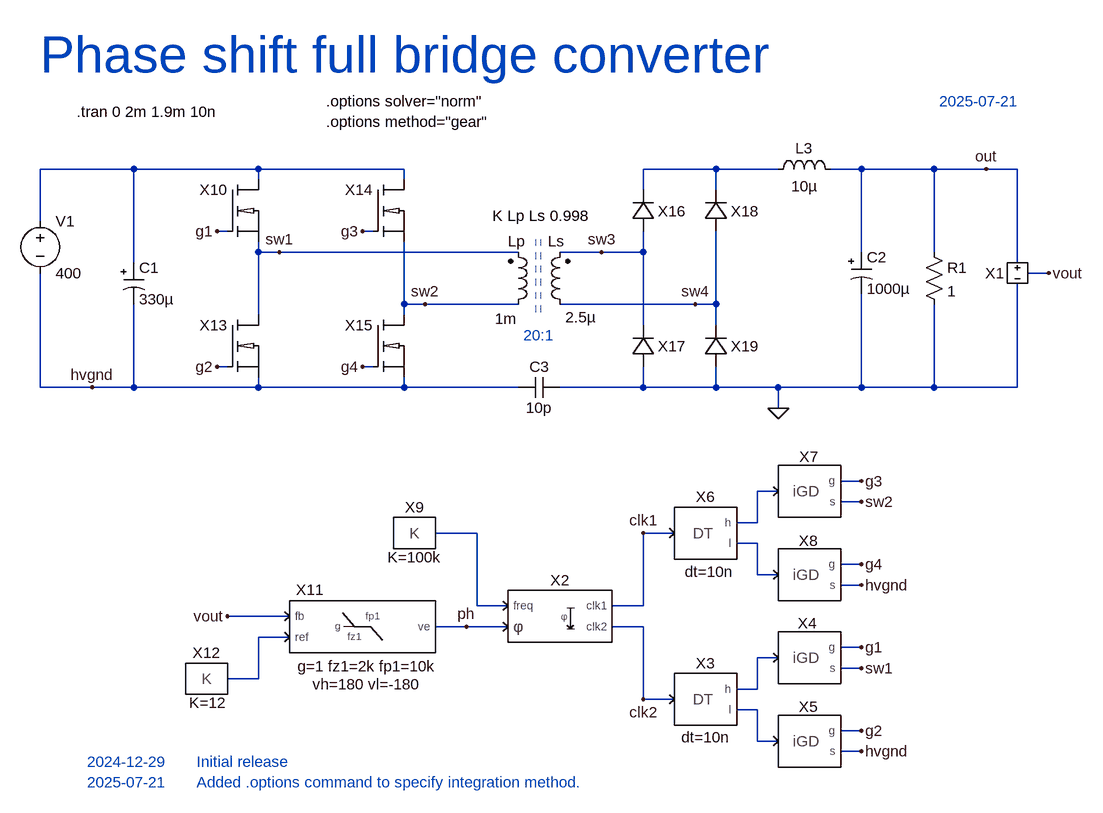
[diagram p0: schematic PSFB2.asc]
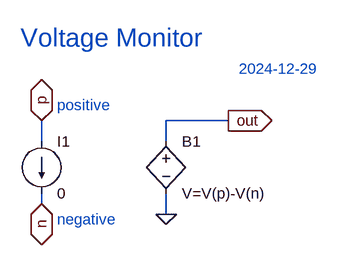
[diagram p1: sub-circuit vmon.asc]
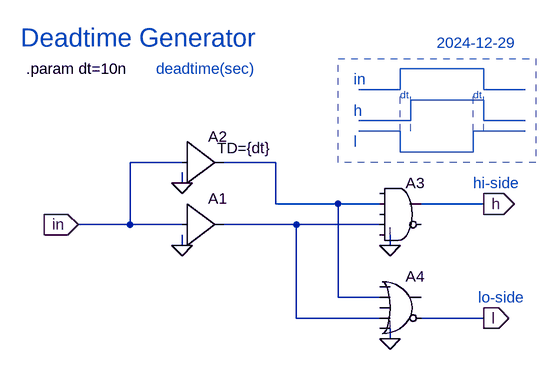
[diagram p2: sub-circuit deadtime.asc]
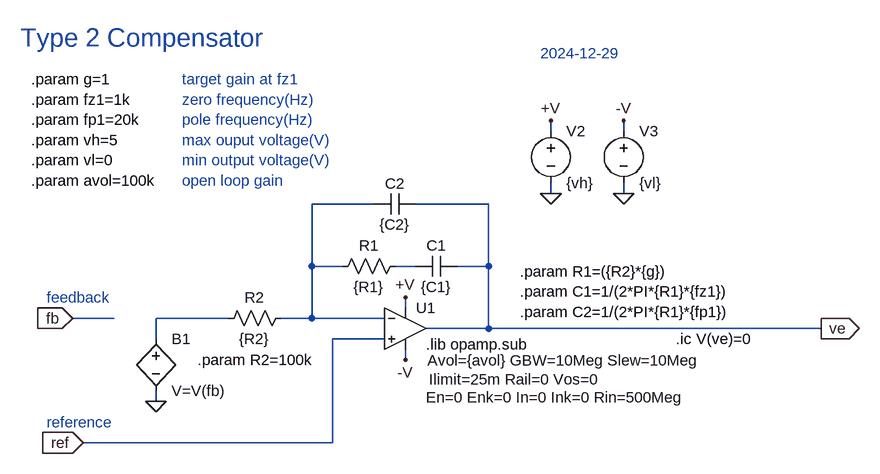
[diagram p3: sub-circuit type2.asc]
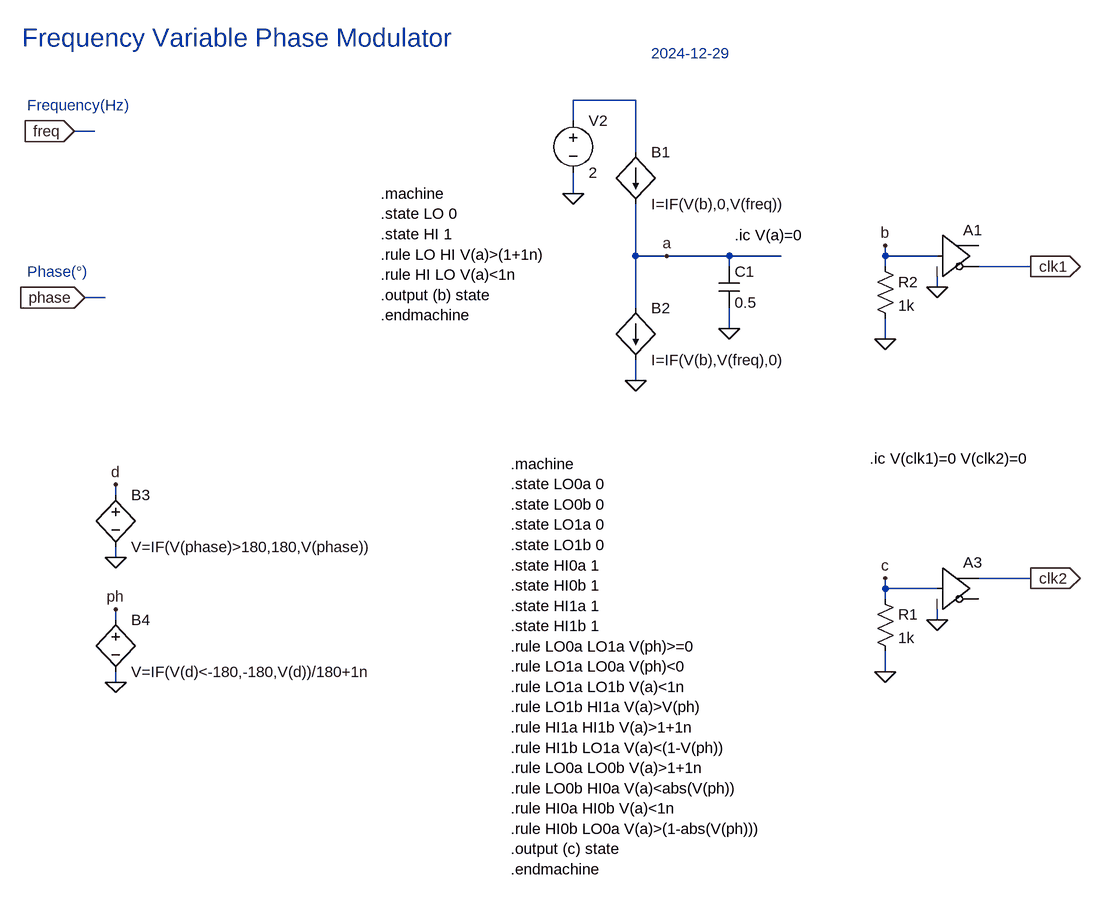
[diagram p4: sub-circuit phaseshift2.asc]
PSFB2.asc, the LTspice schematic file:
Version 4.1
SHEET 1 1968 1000
WIRE 128 -16 -16 -16
WIRE 320 -16 128 -16
WIRE 544 -16 320 -16
WIRE 1024 -16 912 -16
WIRE 1120 -16 1024 -16
WIRE 1248 -16 1200 -16
WIRE 1360 -16 1248 -16
WIRE 1440 -16 1360 -16
WIRE 1488 -16 1440 -16
WIRE 320 0 320 -16
WIRE 544 0 544 -16
WIRE 912 16 912 -16
WIRE 1024 16 1024 -16
WIRE -16 64 -16 -16
WIRE 272 80 256 80
WIRE 496 80 480 80
WIRE 320 112 320 96
WIRE 352 112 320 112
WIRE 720 112 352 112
WIRE 848 112 784 112
WIRE 912 112 912 80
WIRE 912 112 848 112
WIRE 1248 112 1248 -16
WIRE 1360 112 1360 -16
WIRE 128 128 128 -16
WIRE 1488 128 1488 -16
WIRE 1536 144 1504 144
WIRE 544 192 544 96
WIRE 576 192 544 192
WIRE 720 192 576 192
WIRE 992 192 784 192
WIRE 1024 192 1024 80
WIRE 1024 192 992 192
WIRE 320 208 320 112
WIRE 544 208 544 192
WIRE 912 224 912 112
WIRE 1024 224 1024 192
WIRE 272 288 256 288
WIRE 496 288 480 288
WIRE -16 320 -16 144
WIRE 64 320 -16 320
WIRE 128 320 128 192
WIRE 128 320 64 320
WIRE 320 320 320 304
WIRE 320 320 128 320
WIRE 544 320 544 304
WIRE 544 320 320 320
WIRE 720 320 544 320
WIRE 912 320 912 288
WIRE 912 320 784 320
WIRE 1024 320 1024 288
WIRE 1024 320 912 320
WIRE 1120 320 1024 320
WIRE 1248 320 1248 176
WIRE 1248 320 1120 320
WIRE 1360 320 1360 192
WIRE 1360 320 1248 320
WIRE 1488 320 1488 160
WIRE 1488 320 1360 320
WIRE 1120 352 1120 320
WIRE 1248 464 1216 464
WIRE 1120 480 1088 480
WIRE 1248 496 1216 496
WIRE 1088 528 1088 480
WIRE 1088 528 1056 528
WIRE 656 544 592 544
WIRE 960 544 912 544
WIRE 1088 560 1056 560
WIRE 1248 592 1216 592
WIRE 1088 608 1088 560
WIRE 1120 608 1088 608
WIRE 1248 624 1216 624
WIRE 656 656 656 544
WIRE 704 656 656 656
WIRE 912 656 912 544
WIRE 912 656 864 656
WIRE 368 672 272 672
WIRE 640 688 592 688
WIRE 704 688 640 688
WIRE 912 688 864 688
WIRE 368 704 320 704
WIRE 1248 720 1216 720
WIRE 1120 736 1088 736
WIRE 1248 752 1216 752
WIRE 320 768 320 704
WIRE 320 768 272 768
WIRE 1088 784 1088 736
WIRE 1088 784 1056 784
WIRE 912 800 912 688
WIRE 960 800 912 800
WIRE 1088 816 1056 816
WIRE 1248 848 1216 848
WIRE 1088 864 1088 816
WIRE 1120 864 1088 864
WIRE 1248 880 1216 880
FLAG 256 80 g1
FLAG 256 288 g2
FLAG 352 112 sw1
FLAG 480 80 g3
FLAG 480 288 g4
FLAG 576 192 sw2
FLAG 1440 -16 out
FLAG 1536 144 vout
FLAG 1248 720 g1
FLAG 1248 752 sw1
FLAG 1248 848 g2
FLAG 1248 464 g3
FLAG 1248 496 sw2
FLAG 1248 592 g4
FLAG 272 672 vout
FLAG 640 688 ph
FLAG 912 544 clk1
FLAG 912 800 clk2
FLAG 64 320 hvgnd
FLAG 1248 624 hvgnd
FLAG 1248 880 hvgnd
FLAG 848 112 sw3
FLAG 992 192 sw4
FLAG 1120 352 0
SYMBOL voltage -16 48 R0
WINDOW 123 0 0 Left 0
WINDOW 39 0 0 Left 0
SYMATTR InstName V1
SYMATTR Value 400
SYMBOL polcap 112 128 R0
WINDOW 3 24 56 Left 2
SYMATTR Value 330µ
SYMATTR InstName C1
SYMATTR Description Capacitor
SYMATTR Type cap
SYMATTR SpiceLine Irms=1.5 Rser=0.1
SYMBOL ind2 704 208 M180
WINDOW 0 0 113 Left 2
WINDOW 3 -20 -6 Left 2
SYMATTR InstName Lp
SYMATTR Value 1m
SYMATTR SpiceLine Rser=1m
SYMBOL ind2 800 208 R180
WINDOW 0 9 113 Left 2
WINDOW 3 -40 -4 Left 2
SYMATTR InstName Ls
SYMATTR Value 2.5µ
SYMATTR SpiceLine Rser=1m
SYMBOL ind 1104 0 R270
WINDOW 0 32 56 VTop 2
WINDOW 3 5 56 VBottom 2
SYMATTR InstName L3
SYMATTR Value 10µ
SYMATTR SpiceLine Rser=1m
SYMBOL polcap 1232 112 R0
WINDOW 3 24 56 Left 2
SYMATTR Value 1000µ
SYMATTR InstName C2
SYMATTR Description Capacitor
SYMATTR Type cap
SYMATTR SpiceLine Rser=0.1
SYMBOL VMON 1488 144 R0
SYMATTR InstName X1
SYMBOL DEADTIME 1008 800 R0
WINDOW 39 0 74 Bottom 2
SYMATTR InstName X3
SYMBOL iGD 1168 736 R0
WINDOW 0 -3 -69 Top 2
SYMATTR InstName X4
SYMBOL iGD 1168 864 R0
WINDOW 0 -2 -68 Top 2
SYMATTR InstName X5
SYMBOL DEADTIME 1008 544 R0
WINDOW 39 6 75 Bottom 2
SYMATTR InstName X6
SYMBOL iGD 1168 480 R0
WINDOW 0 -1 -69 Top 2
SYMATTR InstName X7
SYMBOL iGD 1168 608 R0
WINDOW 0 -2 -68 Top 2
SYMATTR InstName X8
SYMBOL res 1344 96 R0
SYMATTR InstName R1
SYMATTR Value 1
SYMBOL TYPE2 480 688 R0
WINDOW 0 -81 -57 Center 2
WINDOW 39 7 61 Center 2
WINDOW 40 7 89 Center 2
SYMATTR InstName X11
SYMATTR SpiceLine g=1 fz1=2k fp1=10k
SYMATTR SpiceLine2 vh=180 vl=-180
SYMBOL CONST 240 768 R0
WINDOW 39 2 53 Bottom 2
SYMATTR SpiceLine K=12
SYMATTR InstName X12
SYMBOL PHASESHIFT2 784 672 R0
WINDOW 0 0 -71 Top 2
SYMATTR InstName X2
SYMBOL CONST 560 544 R0
WINDOW 39 0 53 Bottom 2
SYMATTR SpiceLine K=100k
SYMATTR InstName X9
SYMBOL iD 912 48 R180
SYMATTR InstName X16
SYMBOL iD 912 256 R180
SYMATTR InstName X17
SYMBOL iD 1024 48 R180
SYMATTR InstName X18
SYMBOL iD 1024 256 R180
SYMATTR InstName X19
SYMBOL iNMOS 320 48 R0
SYMATTR InstName X10
SYMBOL iNMOS 320 256 R0
SYMATTR InstName X13
SYMBOL iNMOS 544 48 R0
SYMATTR InstName X14
SYMBOL iNMOS 544 256 R0
SYMATTR InstName X15
SYMBOL cap 784 304 R90
WINDOW 0 0 32 VBottom 2
WINDOW 3 32 32 VTop 2
SYMATTR InstName C3
SYMATTR Value 10p
TEXT 680 56 Left 2 !K Lp Ls 0.998
TEXT 728 240 Left 2 ;20:1
TEXT 40 -104 Left 2 !.tran 0 2m 1.9m 10n
TEXT -16 -192 Left 6 ;Phase shift full bridge converter
TEXT 1368 -120 Left 2 ;2025-07-21
TEXT 424 -120 Left 2 !.options solver="norm"\n.options method="gear"
TEXT 56 896 Left 2 ;2024-12-29       Initial release\n2025-07-21       Added .options command to specify integration method.
LINE Normal 747 204 747 92 1
LINE Normal 755 204 755 92 1

vmon.asc, the sub-circuit schematic file:
Version 4
SHEET 1 880 680
WIRE 176 -32 80 -32
WIRE -112 0 -112 -32
WIRE 80 0 80 -32
WIRE -112 96 -112 80
WIRE 80 112 80 80
FLAG -112 -32 p
IOPIN -112 -32 BiDir
FLAG -112 96 n
IOPIN -112 96 BiDir
FLAG 176 -32 out
IOPIN 176 -32 Out
FLAG 80 112 0
SYMBOL bv 80 -16 R0
SYMATTR InstName B1
SYMATTR Value V=V(p)-V(n)
SYMBOL current -112 0 R0
WINDOW 123 0 0 Left 0
WINDOW 39 0 0 Left 0
SYMATTR InstName I1
SYMATTR Value 0
TEXT -144 -160 Left 4 ;Voltage Monitor
TEXT -88 -56 Left 2 ;positive
TEXT -88 120 Left 2 ;negative
TEXT 192 -112 Left 2 ;2024-12-29

deadtime.asc, the sub-circuit schematic file:
Version 4
SHEET 1 1412 1312
WIRE 64 288 -16 288
WIRE 208 288 128 288
WIRE 64 320 64 304
WIRE 208 352 208 288
WIRE 304 352 208 352
WIRE 368 352 304 352
WIRE 528 352 432 352
WIRE -16 384 -16 288
WIRE -16 384 -96 384
WIRE 64 384 -16 384
WIRE 240 384 128 384
WIRE 368 384 240 384
WIRE 64 416 64 400
WIRE 384 416 384 400
WIRE 304 496 304 352
WIRE 368 496 304 496
WIRE 240 528 240 384
WIRE 368 528 240 528
WIRE 528 528 432 528
WIRE 384 560 384 544
FLAG -96 384 in
IOPIN -96 384 In
FLAG 64 416 0
FLAG 64 320 0
FLAG 384 416 0
FLAG 384 560 0
FLAG 528 352 h
IOPIN 528 352 Out
FLAG 528 528 l
IOPIN 528 528 Out
SYMBOL Digital\\buf1 64 320 R0
SYMATTR InstName A1
SYMBOL Digital\\buf1 64 224 R0
WINDOW 3 54 42 Left 2
SYMATTR Value TD={dt}
SYMATTR InstName A2
SYMBOL Digital\\and 400 304 R0
SYMATTR InstName A3
SYMBOL Digital\\or 400 448 R0
SYMATTR InstName A4
TEXT -176 144 Left 2 !.param dt=10n
TEXT -184 96 Left 4 ;Deadtime Generator
TEXT 24 144 Left 2 ;deadtime(sec)
TEXT 512 320 Left 2 ;hi-side
TEXT 520 496 Left 2 ;lo-side
TEXT 328 160 Left 2 ;in
TEXT 328 208 Left 2 ;h
TEXT 328 256 Left 2 ;l
TEXT 400 184 Left 1 ;dt
TEXT 512 184 Left 1 ;dt
TEXT 456 104 Left 2 ;2024-12-29
LINE Normal 400 176 336 176
LINE Normal 400 176 400 144
LINE Normal 528 144 400 144
LINE Normal 528 176 528 144
LINE Normal 592 176 528 176
LINE Normal 416 224 336 224
LINE Normal 416 224 416 192
LINE Normal 528 192 416 192
LINE Normal 528 224 528 192
LINE Normal 592 224 528 224
LINE Normal 400 240 336 240
LINE Normal 400 272 400 240
LINE Normal 512 272 400 272
LINE Normal 512 272 512 240
LINE Normal 592 240 512 240
LINE Normal 400 240 400 176 2
LINE Normal 512 240 512 176 2
LINE Normal 416 240 416 176 2
LINE Normal 528 240 528 176 2
RECTANGLE Normal 608 288 304 128 2

type2.asc, the sub-circuit schematic file:
Version 4
SHEET 1 1008 680
WIRE 464 -144 464 -160
WIRE 576 -144 576 -160
WIRE 464 -48 464 -64
WIRE 576 -48 576 -64
WIRE 192 -32 96 -32
WIRE 368 -32 256 -32
WIRE 96 64 96 -32
WIRE 144 64 96 64
WIRE 256 64 224 64
WIRE 368 64 368 -32
WIRE 368 64 320 64
WIRE 240 128 240 112
WIRE -208 144 -272 144
WIRE -32 144 -144 144
WIRE 96 144 96 64
WIRE 96 144 48 144
WIRE 208 144 96 144
WIRE 368 160 368 64
WIRE 368 160 272 160
WIRE 880 160 368 160
WIRE -144 176 -144 144
WIRE 208 176 128 176
WIRE 240 208 240 192
WIRE -144 272 -144 256
WIRE 128 336 128 176
WIRE 128 336 -256 336
FLAG -272 144 fb
IOPIN -272 144 In
FLAG -256 336 ref
IOPIN -256 336 In
FLAG -144 272 0
FLAG 880 160 ve
IOPIN 880 160 Out
FLAG 576 -48 0
FLAG 464 -48 0
FLAG 464 -160 +V
FLAG 576 -160 -V
FLAG 240 112 +V
FLAG 240 208 -V
SYMBOL res 240 48 R90
WINDOW 0 0 56 VBottom 2
WINDOW 3 32 56 VTop 2
SYMATTR InstName R1
SYMATTR Value {R1}
SYMBOL cap 320 48 R90
WINDOW 0 0 32 VBottom 2
WINDOW 3 32 32 VTop 2
SYMATTR InstName C1
SYMATTR Value {C1}
SYMBOL cap 256 -48 R90
WINDOW 0 0 32 VBottom 2
WINDOW 3 32 32 VTop 2
SYMATTR InstName C2
SYMATTR Value {C2}
SYMBOL bv -144 160 R0
SYMATTR InstName B1
SYMATTR Value V=V(fb)
SYMBOL res 64 128 R90
WINDOW 0 0 56 VBottom 2
WINDOW 3 32 56 VTop 2
SYMATTR InstName R2
SYMATTR Value {R2}
SYMBOL UniversalOpAmp2 240 160 R0
WINDOW 123 34 49 Left 2
WINDOW 39 36 78 Left 2
WINDOW 40 32 106 Left 2
SYMATTR Value2 Avol={avol} GBW=10Meg Slew=10Meg
SYMATTR InstName U1
SYMBOL voltage 464 -160 R0
SYMATTR InstName V2
SYMATTR Value {vh}
SYMBOL voltage 576 -160 R0
SYMATTR InstName V3
SYMATTR Value {vl}
TEXT 272 184 Left 2 !.lib opamp.sub
TEXT -336 -224 Left 2 !.param g=1\n.param fz1=1k\n.param fp1=20k\n.param vh=5\n.param vl=0\n.param avol=100k
TEXT 416 72 Left 2 !.param R1=({R2}*{g})\n.param C1=1/(2*PI*{R1}*{fz1})\n.param C2=1/(2*PI*{R1}*{fp1})
TEXT -352 -288 Left 4 ;Type 2 Compensator
TEXT -80 208 Left 2 !.param R2=100k
TEXT -104 -224 Left 2 ;target gain at fz1\nzero frequency(Hz)\npole frequency(Hz)\nmax ouput voltage(V)\nmin output voltage(V)\nopen loop gain
TEXT -312 112 Left 2 ;feedback
TEXT -312 304 Left 2 ;reference
TEXT 656 176 Left 2 !.ic V(ve)=0
TEXT 448 -264 Left 2 ;2024-12-29

phaseshift2.asc, the sub-circuit schematic file:
Version 4
SHEET 1 1572 1312
WIRE -128 -112 -224 -112
WIRE -224 -80 -224 -112
WIRE -960 -64 -992 -64
WIRE -128 -32 -128 -112
WIRE -224 32 -224 0
WIRE -128 128 -128 48
WIRE -80 128 -128 128
WIRE 16 128 -80 128
WIRE 96 128 16 128
WIRE 256 128 256 112
WIRE 336 128 256 128
WIRE 16 144 16 128
WIRE 256 144 256 128
WIRE 480 144 400 144
WIRE 336 176 336 160
WIRE -944 192 -976 192
WIRE -128 208 -128 128
WIRE 16 240 16 208
WIRE 256 256 256 224
WIRE -128 320 -128 288
WIRE -928 496 -928 480
WIRE -928 592 -928 576
WIRE 480 624 400 624
WIRE 256 640 256 624
WIRE 336 640 256 640
WIRE 256 656 256 640
WIRE -928 688 -928 672
WIRE 336 688 336 672
WIRE 256 768 256 736
WIRE -928 784 -928 768
FLAG -992 -64 freq
IOPIN -992 -64 In
FLAG 16 240 0
FLAG -224 32 0
FLAG -976 192 phase
IOPIN -976 192 In
FLAG -128 320 0
FLAG 256 256 0
FLAG -80 128 a
FLAG -928 592 0
FLAG -928 480 d
FLAG 480 144 clk1
IOPIN 480 144 Out
FLAG 336 176 0
FLAG 256 112 b
FLAG 256 768 0
FLAG 480 624 clk2
IOPIN 480 624 Out
FLAG 336 688 0
FLAG 256 624 c
FLAG -928 784 0
FLAG -928 672 ph
SYMBOL cap 0 144 R0
SYMATTR InstName C1
SYMATTR Value 0.5
SYMBOL voltage -224 -96 R0
WINDOW 123 0 0 Left 0
WINDOW 39 0 0 Left 0
SYMATTR InstName V2
SYMATTR Value 2
SYMBOL bi -128 -32 R0
SYMATTR InstName B1
SYMATTR Value I=IF(V(b),0,V(freq))
SYMBOL bi -128 208 R0
SYMATTR InstName B2
SYMATTR Value I=IF(V(b),V(freq),0)
SYMBOL res 240 128 R0
SYMATTR InstName R2
SYMATTR Value 1k
SYMBOL bv -928 480 R0
SYMATTR InstName B3
SYMATTR Value V=IF(V(phase)>180,180,V(phase))
SYMBOL Digital\\buf 336 64 R0
SYMATTR InstName A1
SYMBOL res 240 640 R0
SYMATTR InstName R1
SYMATTR Value 1k
SYMBOL Digital\\buf 336 576 R0
SYMATTR InstName A3
SYMBOL bv -928 672 R0
SYMATTR InstName B4
SYMATTR Value V=IF(V(d)<-180,-180,V(d))/180+1n
TEXT -520 32 Left 2 !.machine\n.state LO 0\n.state HI 1\n.rule LO HI V(a)>(1+1n)\n.rule HI LO V(a)<1n\n.output (b) state\n.endmachine
TEXT 24 96 Left 2 !.ic V(a)=0
TEXT -320 448 Left 2 !.machine\n.state LO0a 0\n.state LO0b 0\n.state LO1a 0\n.state LO1b 0\n.state HI0a 1\n.state HI0b 1\n.state HI1a 1\n.state HI1b 1\n.rule LO0a LO1a V(ph)>=0\n.rule LO1a LO0a V(ph)<0\n.rule LO1a LO1b V(a)<1n\n.rule LO1b HI1a V(a)>V(ph)\n.rule HI1a HI1b V(a)>1+1n\n.rule HI1b LO1a V(a)<(1-V(ph))\n.rule LO0a LO0b V(a)>1+1n\n.rule LO0b HI0a V(a)<abs(V(ph))\n.rule HI0a HI0b V(a)<1n\n.rule HI0b LO0a V(a)>(1-abs(V(ph)))\n.output (c) state\n.endmachine
TEXT 232 440 Left 2 !.ic V(clk1)=0 V(clk2)=0
TEXT -1072 -208 Left 4 ;Frequency Variable Phase Modulator
TEXT -1064 -104 Left 2 ;Frequency(Hz)
TEXT -1064 152 Left 2 ;Phase(°)
TEXT -104 -184 Left 2 ;2024-12-29

The netlist it stands for:
* PSFB2.asc
V1 N001 hvgnd 400
C1 N001 hvgnd 330µ Irms=1.5 Rser=0.1
Lp sw2 sw1 1m Rser=1m
Ls sw4 sw3 2.5µ Rser=1m
L3 N002 out 10µ Rser=1m
C2 out 0 1000µ Rser=0.1
X§X1 0 vout out vmon
X§X3 clk2 N008 N007 deadtime params: dt=10n
X§X4 N007 g1 sw1 iGD  ; pins in g s
X§X5 N008 g2 hvgnd iGD  ; pins in g s
X§X6 clk1 N005 N003 deadtime params: dt=10n
X§X7 N003 g3 sw2 iGD  ; pins in g s
X§X8 N005 g4 hvgnd iGD  ; pins in g s
R1 out 0 1
X§X11 vout N006 ph type2 params: avol=100k g=1 fz1=2k fp1=10k vh=180 vl=-180
X§X12 N006 CONST K=12  ; pins K
X§X2 N004 ph clk1 clk2 phaseshift2
X§X9 N004 CONST K=100k  ; pins K
X§X16 sw3 N002 iD params: von=1n ron=10m esl=1f rsnb=1k csnb=10p  ; pins AN CA
X§X17 0 sw3 iD params: von=1n ron=10m esl=1f rsnb=1k csnb=10p  ; pins AN CA
X§X18 sw4 N002 iD params: von=1n ron=10m esl=1f rsnb=1k csnb=10p  ; pins AN CA
X§X19 0 sw4 iD params: von=1n ron=10m esl=1f rsnb=1k csnb=10p  ; pins AN CA
X§X10 N001 g1 sw1 iNMOS params: esl=1f rsnb=1k csnb=10p ron=10m  ; pins D G S
X§X13 sw1 g2 hvgnd iNMOS params: esl=1f rsnb=1k csnb=10p ron=10m  ; pins D G S
X§X14 N001 g3 sw2 iNMOS params: esl=1f rsnb=1k csnb=10p ron=10m  ; pins D G S
X§X15 sw2 g4 hvgnd iNMOS params: esl=1f rsnb=1k csnb=10p ron=10m  ; pins D G S
C3 0 hvgnd 10p

* block symbol definitions
.subckt vmon n out p
B1 out 0 V=V(p)-V(n)
I1 p n 0
* Voltage Monitor
* positive
* negative
* 2024-12-29
.ends vmon

.subckt deadtime in l h
A1 in 0 0 0 0 0 N002 0 BUF
A2 in 0 0 0 0 0 N001 0 BUF TD={dt}
A3 0 N001 0 N002 0 0 h 0 AND
A4 0 N001 0 N002 0 l 0 0 OR
.param dt=10n
* Deadtime Generator
* deadtime(sec)
* hi-side
* lo-side
* in
* h
* l
* dt
* dt
* 2024-12-29
.ends deadtime

.subckt type2 fb ref ve
R1 N002 N001 {R1}
C1 ve N002 {C1}
C2 ve N001 {C2}
B1 N003 0 V=V(fb)
R2 N001 N003 {R2}
XU1 ref N001 +V -V ve level2 Avol={avol} GBW=10Meg Slew=10Meg Ilimit=25m Rail=0 Vos=0 En=0 Enk=0 In=0 Ink=0 Rin=500Meg  ; pins In+ In- V+ V- OUT
V2 +V 0 {vh}
V3 -V 0 {vl}
.lib opamp.sub
.param g=1
.param fz1=1k
.param fp1=20k
.param vh=5
.param vl=0
.param avol=100k
.param R1=({R2}*{g})
.param C1=1/(2*PI*{R1}*{fz1})
.param C2=1/(2*PI*{R1}*{fp1})
* Type 2 Compensator
.param R2=100k
* target gain at fz1
* zero frequency(Hz)
* pole frequency(Hz)
* max ouput voltage(V)
* min output voltage(V)
* open loop gain
* feedback
* reference
.ic V(ve)=0
* 2024-12-29
.ends type2

.subckt phaseshift2 freq phase clk1 clk2
C1 a 0 0.5
V2 N001 0 2
B1 N001 a I=IF(V(b),0,V(freq))
B2 a 0 I=IF(V(b),V(freq),0)
R2 b 0 1k
B3 d 0 V=IF(V(phase)>180,180,V(phase))
A1 b 0 0 0 0 clk1 0 0 BUF
R1 c 0 1k
A3 c 0 0 0 0 0 clk2 0 BUF
B4 ph 0 V=IF(V(d)<-180,-180,V(d))/180+1n
.machine
.state LO 0
.state HI 1
.rule LO HI V(a)>(1+1n)
.rule HI LO V(a)<1n
.output (b) state
.endmachine
.ic V(a)=0
.machine
.state LO0a 0
.state LO0b 0
.state LO1a 0
.state LO1b 0
.state HI0a 1
.state HI0b 1
.state HI1a 1
.state HI1b 1
.rule LO0a LO1a V(ph)>=0
.rule LO1a LO0a V(ph)<0
.rule LO1a LO1b V(a)<1n
.rule LO1b HI1a V(a)>V(ph)
.rule HI1a HI1b V(a)>1+1n
.rule HI1b LO1a V(a)<(1-V(ph))
.rule LO0a LO0b V(a)>1+1n
.rule LO0b HI0a V(a)<abs(V(ph))
.rule HI0a HI0b V(a)<1n
.rule HI0b LO0a V(a)>(1-abs(V(ph)))
.output (c) state
.endmachine
.ic V(clk1)=0 V(clk2)=0
* Frequency Variable Phase Modulator
* Frequency(Hz)
* Phase(°)
* 2024-12-29
.ends phaseshift2

K Lp Ls 0.998
* 20:1
.tran 0 2m 1.9m 10n
* Phase shift full bridge converter
* 2025-07-21
.options solver="norm"
.options method="gear"
* 2024-12-29       Initial release
* 2025-07-21       Added .options command to specify integration method.
.lib UniversalOpAmp2.lib
.backanno
.end